# Altium schematic sheet Camera Board.SchDoc
size A4; SheetNumber: 1; SheetTotal: 1
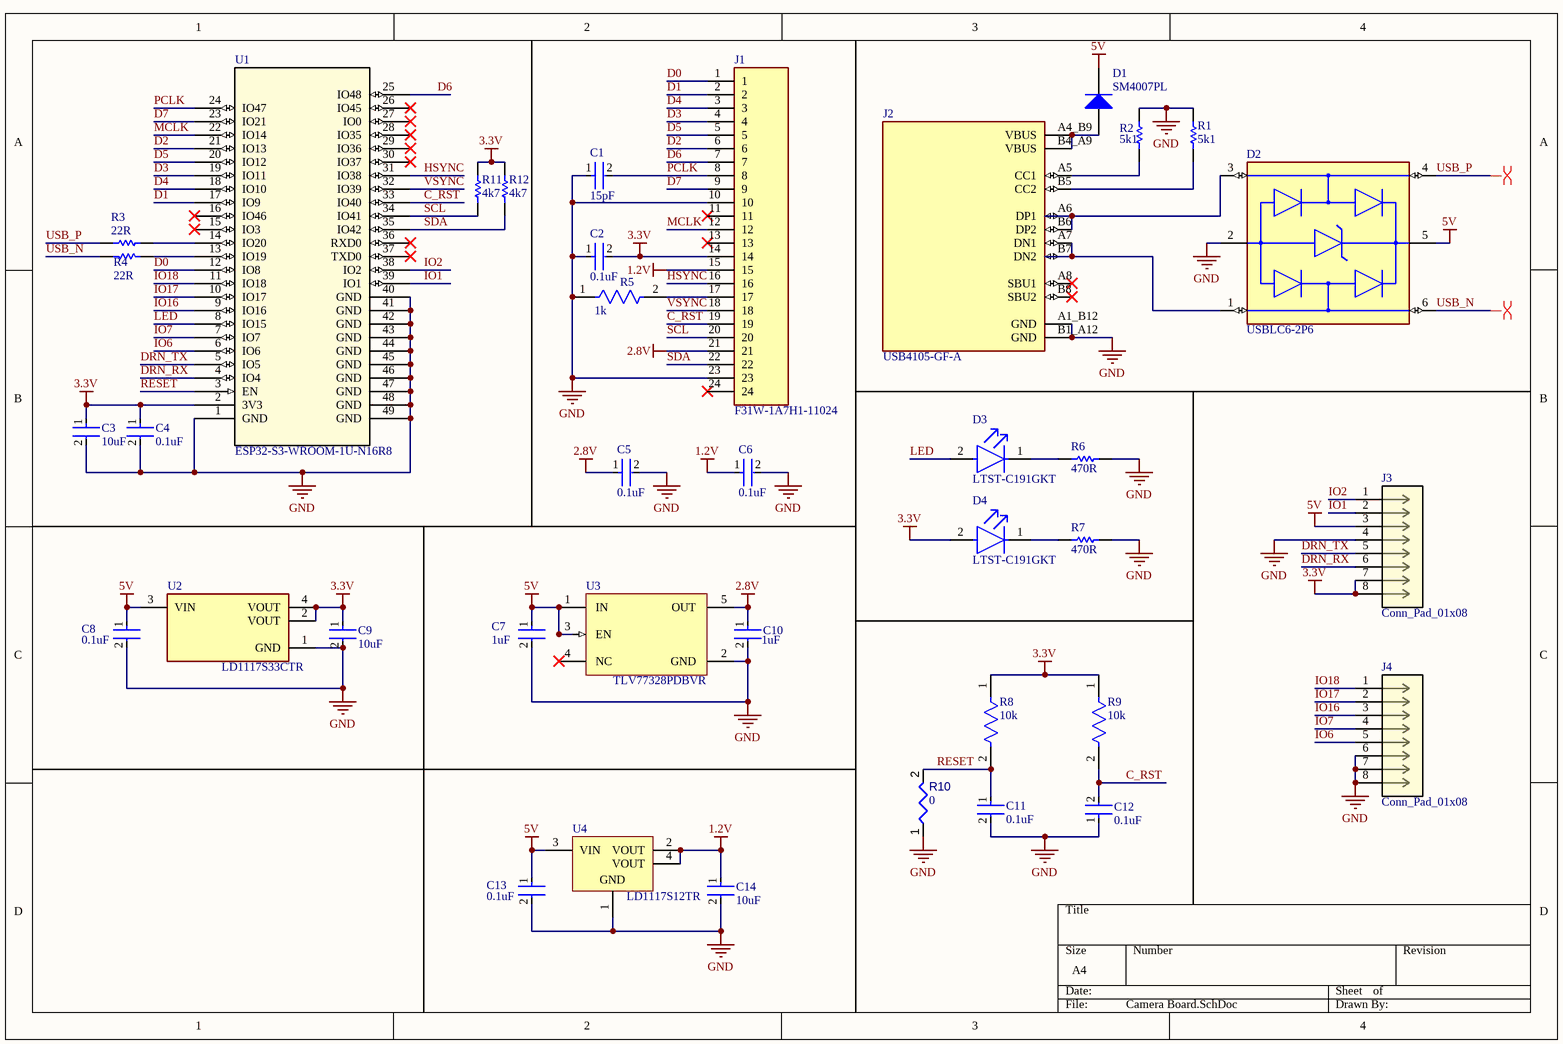
[diagram p0: Camera Board.SchDoc]

## Parts
C1  15pF  [FP-CC0402-0_55-IPC_B]
C2  0.1uF  [FP-GRM155-0_05-IPC_B]
C3  10uF  [FP-GRM18-0_15-MFG]
C4  0.1uF  [FP-CC0603-DA-MFG]
C5  0.1uF  [FP-GRM155-0_05-IPC_B]
C6  0.1uF  [FP-GRM155-0_05-IPC_B]
C7  1uF  [FP-CC0603-DB-MFG]
C8  0.1uF  [FP-CC0603-DA-MFG]
C9  10uF  [FP-GRM18-0_15-MFG]
C10  1uF  [FP-CC0603-DB-MFG]
C11  0.1uF  [FP-CC0603-DA-MFG]
C12  0.1uF  [FP-GRM155-0_05-IPC_B]
C13  0.1uF  [FP-CC0603-DA-MFG]
C14  10uF  [FP-GRM18-0_15-MFG]
D1  SM4007PL  [MCC-SOD-123FL_V]
D2  USBLC6-2P6  [FP-SOT-666-MFG]
D3  LTST-C191GKT  [FP-LTST-C191GKT-MFG]
D4  LTST-C191GKT  [FP-LTST-C191GKT-MFG]
J1  F31W-1A7H1-11024  [AMPHENOL_F31W-1A7H1-11024]
J2  USB4105-GF-A  [GCT_USB4105-GF-A]
J3  Conn_Pad_01x08  [CONN_SM08B-GHS-TB_JST]
J4  Conn_Pad_01x08  [CONN_SM08B-GHS-TB_JST]
R1  5k1  [RESC1608X55X25ML10T15]
R2  5k1  [RESC1608X55X25ML10T15]
R3  22R  [RESC1608X55X25NL10T15]
R4  22R  [RESC1608X55X25NL10T15]
R5  1k  [FP-RC0603-0_55-IPC_C]
R6  470R  [RESC1608X55X25LL10T15]
R7  470R  [RESC1608X55X25LL10T15]
R8  10k  [FP-RC0603-0_55-IPC_C]
R9  10k  [FP-RC0603-0_55-IPC_C]
R10  value 0  [RESC0603(1608)_L]  (hidden comment: Jumper 0603)
R11  4k7  [RESC1608X55X25LL10T15]
R12  4k7  [RESC1608X55X25LL10T15]
U1  ESP32-S3-WROOM-1U-N16R8  [ESP32-S3-WROOM-1U_EXP]
U2  LD1117S33CTR  [FP-SOT-223-0046067_14-MFG]
U3  TLV77328PDBVR  [DBV0005A_MFG]
U4  LD1117S12TR  [SOT-223_M]

## Nets
1.2V: C6.1 C14.1 J1.15 U4.2(VOUT) U4.4(VOUT)
2.8V: C5.1 C10.1 J1.21 U3.5(OUT)
3.3V: C2.2 C3.1 C4.1 C9.1 D4.2(A) J1.14 J3.7 J3.8 R8.1 R9.1 R11.2 R12.2 U1.2(3V3) U2.2(VOUT) U2.4(VOUT)
5V: C7.1 C8.1 C13.1 D1.2(K) D2.5(VBUS) J3.3 U2.3(VIN) U3.1(IN) U3.3(EN) U4.3(VIN)
GND: C1.1 C2.1 C3.2 C4.2 C5.2 C6.2 C7.2 C8.2 C9.2 C10.2 C11.2 C12.1 C13.2 C14.2 D2.2(GND) J1.10 J1.23 J2.A1_B12(GND) J2.B1_A12(GND) J3.4 J4.6 J4.7 J4.8 R1.2 R2.2 R5.1 R6.2 R7.2 R10.1 U1.1(GND) U1.40(GND) U1.41(GND) U1.42(GND) U1.43(GND) U1.44(GND) U1.45(GND) U1.46(GND) U1.47(GND) U1.48(GND) U1.49(GND) U2.1(GND) U3.2(GND) U4.1(GND)
C_RST: C12.2 J1.19 R9.2 U1.33(IO40)
D0: J1.1 U1.12(IO8)
D1: J1.2 U1.17(IO9)
D2: J1.6 U1.21(IO13)
D3: J1.4 U1.19(IO11)
D4: J1.3 U1.18(IO10)
D5: J1.5 U1.20(IO12)
D6: J1.7 U1.25(IO48)
D7: J1.9 U1.23(IO21)
DRN_RX: J3.6 U1.4(IO4)
DRN_TX: J3.5 U1.5(IO5)
HSYNC: J1.16 U1.31(IO38)
IO1: J3.2 U1.39(IO1)
IO2: J3.1 U1.38(IO2)
IO6: J4.5 U1.6(IO6)
IO7: J4.4 U1.7(IO7)
IO16: J4.3 U1.9(IO16)
IO17: J4.2 U1.10(IO17)
IO18: J4.1 U1.11(IO18)
LED: D3.2(A) U1.8(IO15)
MCLK: J1.12 U1.22(IO14)
PCLK: C1.2 J1.8 U1.24(IO47)
RESET: C11.1 R8.2 R10.2 U1.3(EN)
SCL: J1.20 R11.1 U1.34(IO41)
SDA: J1.22 R12.1 U1.35(IO42)
USB_N: D2.6(I/O1) R4.1
USB_P: D2.4(I/O2) R3.1
VSYNC: J1.18 U1.32(IO39)
NetD1_1: D1.1(A) J2.A4_B9(VBUS) J2.B4_A9(VBUS)
NetD2_1: D2.1(I/O1) J2.A7(DN1) J2.B7(DN2)
NetD2_3: D2.3(I/O2) J2.A6(DP1) J2.B6(DP2)
NetD3_1: D3.1(C) R6.1
NetD4_1: D4.1(C) R7.1
NetJ1_17: J1.17 R5.2
NetJ2_A5: J2.A5(CC1) R2.1
NetJ2_B5: J2.B5(CC2) R1.1
NetR3_2: R3.2 U1.14(IO20)
NetR4_2: R4.2 U1.13(IO19)

Not connected (* = marked no-connect by the designer): J1 11* 13* 24*; J2 A8(SBU1)* B8(SBU2)*; U1 15(IO3)* 16(IO46)* 26(IO45)* 27(IO0)* 28(IO35)* 29(IO36)* 30(IO37)* 36(RXD0)* 37(TXD0)*; U3 4(NC)*

## Layout directives
differential pair: USB_N, USB_P

## Library data of the parts
C1 = CMP-03422-001519-1: CAP CER 15PF 50V C0G/NPO 0402; Insulation Resistance: 100GR; Dielectric Material: Ceramic; Tolerance: 5%; Dielectric: C0G; Width: 0.02inch; Case Code (Imperial): 0402; Voltage Rating (DC): 50V; Case Code (Metric): 1005; REACH SVHC: No SVHC; Mount: Surface Mount; Min Operating Temperature: -55°C; Depth: 0.5mm; Voltage Rating: 50V; Voltage: 50V; Thickness: 0.022inch; Length: 1mm; Max Operating Temperature: 125°C; Lead Free: Lead Free; Capacitance: 15pF; Height: 0.5mm; Packaging: Tape and Reel; Radiation Hardening: No; Package Quantity: 1; Case/Package: 0402; Number of Pins: 2; RoHS Compliant: Yes; Resistor Type: Ceramic; Series: CC; Termination: SMD/SMT; JLCNUM: C1548
C2 C5 C6 C12 = CMP-2008-04639-2: Chip Multilayer Ceramic Capacitors for General Purpose, 0402, 0.10uF, X7R, 15%, 10%, 50V; Dissipation Factor: 0.025%; Capacitance: 100nF; Weight: 0.000212oz; Thickness: 0.022inch; Voltage Rating (DC): 50V; Dielectric Material: Ceramic; Termination: SMD/SMT; Case/Package: 0402; Case Code (Imperial): 0402; Mount: Surface Mount; REACH SVHC: No SVHC; Resistor Type: Ceramic; Dielectric: X7R; Max Operating Temperature: 125°C; Voltage: 50V; Lead Free: Lead Free; Package Quantity: 10000; Packaging: Tape and Reel; Length: 1mm; Material: Ceramic; Height: 0.5mm; Depth: 0.5mm; Width: 0.5mm; Min Operating Temperature: -55°C; Tolerance: 10%; Case Code (Metric): 1005; Voltage Rating: 50V; JLCNUM: C307331
  C5 C6: Parameter 1: *
C3 C9 C14 = CMP-2000-05448-2: CAP CER 10UF 10V X5R 0603; Manufacturer Part Number: GRM188R61A106KE69D; Manufacturer: Murata; Temperature Coefficient: 15%; Material: Ceramic; Tolerance: 10%; Device Class L1: Passive Components; ComponentLink2Description: Datasheet; Height: 0.95mm; Package: GRM18-0.15; Octopart: https://octopart.com/grm188r61a106ke69d-murata-22851381; Value: 10uF; Digikey Description: CAP CER 10UF 10V X5R 0603; Temperature Range High: +85°C; Temperature Range Low: -55°C; Temperature Characteristic: X5R; Capacitance: 10uF; RoHS: TRUE; Device Class L2: Capacitors; ComponentLink2URL: https://search.murata.co.jp/Ceramy/image/img/A01X/G101/ENG/GRM188R61A106KE69-01A.pdf; Device Class L3: Ceramic Capacitors; Lead Free: Yes; Mouser Description: Multilayer Ceramic Capacitors MLCC - SMD/SMT 0603 10uF 10volts X5R + - 10%; Category: Cap; Voltage Rating: 10V; Temperature: -55°C to +85°C; Automotive: No; JLCNUM: C19702
C4 C8 C11 C13 = CMP-2100-03601-2: CAP CER 0.1UF 50V X7R 0603; Manufacturer: YAGEO; Manufacturer Part Number: CC0603KRX7R9BB104; Material: Ceramic; Capacitance: 100 nF; Temperature Coefficient: 15%; Tolerance: 0.1; Value: 100 nF; Height: 0.9mm; Voltage: 50 V; ComponentLink2Description: Datasheet; Device Class L2: Capacitors; Temperature Range High: +125°C; Category: Cap; Footprint Url: http://www.yageo.com/exep/pages/download/literatures/UPY-C_GEN_24.pdf; ComponentLink2URL: http://www.yageo.com/documents/recent/UPY-GPHC_X7R_6.3V-to-50V_18.pdf; Package: CC0603-DA; Temperature: -55°C to +125°C; Voltage Rating: 50 V; Temperature Characteristic: X7R; Device Class L1: Passive Components; Temperature Range Low: -55°C; RoHS: TRUE; Automotive: No; Device Class L3: Ceramic Capacitors; Octopart: https://octopart.com/cc0603krx7r9bb104-yageo-42244635; Mouser Description: Multilayer Ceramic Capacitor, CC Series, 0.1 - F, - 10%, X7R, 50 V, 0603 [1608 Metric]; Lead Free: Yes; Digikey Description: CAP CER 0.1UF 50V X7R 0603; JLCNUM: C14663
C7 C10 = CMP-03422-000761-2: CAP CER 1UF 50V X7R 0603; Tolerance: 10%; Lead Free: Lead Free; Max Operating Temperature: 125°C; Width: 0.031inch; Voltage Rating: 50V; Mount: Surface Mount; Resistor Type: Ceramic; Halogen Free: Halogen Free; Weight: 7.1E-05oz; Voltage Rating (DC): 50V; Package Quantity: 4000; Termination: SMD/SMT; Length: 0.063inch; Min Operating Temperature: -55°C; Dielectric: X7R; Case Code (Metric): 1608; Case Code (Imperial): 0603; Packaging: Tape and Reel; Thickness: 0.035inch; Capacitance: 1uF; Case/Package: 0603; JLCNUM: C15849
D1 = CMP-2000-07084-1: Silion Rectifier, 1 A, 1000 V, -65 to 175 degC, 2-Pin SMD, RoHS, Tape and Reel; Manufacturer: Micro Commercial Components; Diode Configuration: Single; Diode Type: StandardRecovery; Forward Surge Current Ifsm Max: 30A; Forward Current If(AV): 1A; Forward Voltage VF Max: 1.1V; Repetitive Reverse Voltage Vrrm Max: 1kV; Manufacturer URL: http://www.mccsemi.com/; Datasheet URL: http://www.mccsemi.com/up_pdf/SM4001PL-SM4007PL(SOD-123FL).PDF; Package Description: 2-Pin Small Outline Diode, Flat Lead, Body 2.825 x 1.65 mm; Datasheet Version: Rev. H, 05/2015; Package Reference: SOD-123FL; Mounting Technology: SurfaceMount; JLCNUM: C64898
D2 = CMP-12225-000058-1: TVS DIODE 5.25V 17V SOT666; Min Breakdown Voltage: 6V; Power Line Protection: Yes; Element Configuration: Dual; Test Current: 1mA; Working Voltage: 5V; Number of Channels: 2; Max Reverse Leakage Current: 150nA; Direction: Unidirectional; Peak Pulse Current: 5A; Number of Elements: 1; Capacitance: 3.5pF; Max Breakdown Voltage: 6V; Height: 0.6mm; Depth: 1.3mm; Contact Plating: Tin; Reverse Breakdown Voltage: 6V; REACH SVHC: No SVHC; Operating Supply Voltage: 5V; Width: 1.3mm; Max Operating Temperature: 125°C; Reverse Standoff Voltage: 5V; ESD Protection: Yes; Package Quantity: 1; Termination: SMD/SMT; Length: 1.7mm; Leakage Current: 150nA; Number of Bidirectional Channels: 2; Case/Package: SOT-666; Min Operating Temperature: -40°C; Number of Pins: 6; Clamping Voltage: 17V; Breakdown Voltage: 6V; Lead Free: Lead Free; Radiation Hardening: No; Packaging: Tape and Reel; Mount: Surface Mount; Polarity: Unidirectional; JLCNUM: C15999
D3 D4 = CMP-22017-000029-1: LED GREEN CLEAR CHIP SMD; Power Dissipation: 100mW; Lens Color: Colorless; Number of Elements: 1; Dominant Wavelength: 569nm; Forward Voltage: 2.1V; Forward Current: 30mA; Test Current: 20mA; Viewing Angle: 130°; Wavelength: 565nm; Luminous Intensity: 12mcd; Reverse Voltage: 5V; Case/Package: 0603; Package Quantity: 1; Illumination Color: Green; Lens Style: Clear; Lens Transparency: Clear; Depth: 0.8mm; Power Rating: 100mW; Width: 0.8mm; Height: 0.55mm; Radiation Hardening: No; Case Code (Imperial): 0603; Number of Pins: 2; Length: 1.6mm; Case Code (Metric): 1608; Max Operating Temperature: 85°C; Color: Green; Packaging: Tape and Reel; Mount: Surface Mount; Min Operating Temperature: -55°C; Lead Free: Lead Free; Number of LEDs: 1; JLCNUM: C99289
J1 = CMP-002-00071-1: Flex Connector, 0.50mm Pitch, Height 4.25mm, Vertical, Slider type, ZIF, 24 position, Without MYLAR; MF: Amphenol ICC / Aorora; MP: F31W-1A7H1-11024; Case/Package: None; Component Type: Standard; Check_prices: https://www.snapeda.com/parts/F31W-1A7H1-11024/Amphenol/view-part/?ref=eda; Pins: 24; Value: *; Design Item ID: F31W-1A7H1-11024; Source: F31W-1A7H1-11024.SchLib; SnapEDA_Link: https://www.snapeda.com/parts/F31W-1A7H1-11024/Amphenol/view-part/?ref=snap; JLCNUM: C5406215
J2 = CMP-003-000000-3: MF: {'manufacturer': u'GCT'}; Source: USB4105-GF-A.SchLib; Value: *; Design Item ID: USB4105-GF-A; Package: None; MP: USB4105-GF-A; Component Type: Standard; Pin Count: 16; Price: None; Availability: Unavailable; JLCNUM: C2765186
J3 J4 = CMP-005-000000-3: Description; RefDes: RefDes; Copyright: Copyright (C) 2026 Ultra Librarian. All rights reserved.; Design Item ID: Conn_Pad_8; Type: Type
R1 R2 = CMP-2000-04091-1: Manufacturer: Yageo; Part Number: RC0603FR-075K1L; JLCNUM: C23186
R3 R4 = CMP-1659-00033-1: Chip Resistor, 22 Ohm, +/- 1%, 0.1 W, -55 to 155 degC, 0603 (1608 Metric), RoHS, Tape and Reel; Max Ouput Current: 8 A; Case\Package: SIP; Max Input Voltage: 1.4 V; ComponentLink2URL: http://www.yageo.com/documents/recent/PYu-RC_Group_51_RoHS_L_04.pdf; RoHSCompliant: true; Max Operating Temperature: 100 degC; PackageDescription: 2-Pin Surface Mount Device, Body 1.6 x 0.8 mm; ComponentLink1Description: Manufacturer URL; ComponentLink1URL: http://www.yageo.com/; Length: 18.5 mm; REACH SVHC: Unknown; Pins: 4; DatasheetVersion: Rev. 4, 02/2016; PackageReference: 0603; Output Current: 8 A; Min Operating Temperature: -25 degC; Height: 19.6 mm; Mount: Through Hole; Radiation Hardening: No; ComponentLink2Description: Datasheet; Package Quantity: 200; Packaging: Rail/Tube; JLCNUM: C23345
R5 = CMP-1659-00009-5: RES 1K OHM 1% 1/10W 0603; Resistance: 1kR; Voltage Rating: 50V; Power Rating: 100mW; Temperature Coefficient: 100ppm/°C; Military Standard: Not; REACH SVHC: No SVHC; Size Code: 0603; Features: Moisture Resistant; Number of Terminations: 2; Technology: THICK FILM; Series: RC; Case Code (Metric): 1608; Resistance Tolerance: 1%; Resistor Type: Thick Film; Termination: SMD/SMT; Contact Plating: Tin; Radiation Hardening: No; Min Operating Temperature: -55°C; Max Operating Temperature: 155°C; Packaging: Tape and Reel; Max Power Dissipation: 100mW; RoHS Compliant: Yes; Height: 0.45mm; Lead Free: Lead Free; Case/Package: 0603; Length: 1.6mm; Tolerance: 1%; Case Code (Imperial): 0603; Construction: Rectangular; Depth: 0.8mm; JLCNUM: C21190
R6 R7 = CMP-1659-00035-2: General Purpose Chip Resistor, 470 Ohm, +/- 1%, -55 to 155 degC, 0603 (1608 Metric), RoHS, Tape and Reel; Resistance: 470 Ohm; ComponentLink1Description: Manufacturer URL; Contact Plating: Gold; Width: 3.1 mm; Radiation Hardening: No; DatasheetVersion: Rev. 4, 04/2009; Length: 3 mm; PackageDescription: 2-Pin Surface Mount Device, Body 1.6 x 0.8 mm; ComponentLink1URL: http://www.yageo.com/; Min Operating Temperature: -40 degC; Mount: Surface Mount; Package Quantity: 2500; ComponentLink2URL: https://datasheet.ciiva.com/11808/0900766b80f96399-11808177.pdf; RoHSCompliant: true; Fastening Type: Snap; PackageReference: 0603; Max Operating Temperature: 90 degC; Height: 1.25 mm; Packaging: Tape and Reel; ComponentLink2Description: Datasheet; Contact Material: Brass; JLCNUM: C23179
R8 R9 = CMP-2100-03664-2: RES 10K OHM 1% 1/10W 0603; Voltage Rating: 75V; Voltage Rating (DC): 50V; Resistance: 10kR; Power Rating: 100mW; Temperature Coefficient: 100ppm/°C; Depth: 0.8mm; Termination: SMD/SMT; Resistor Type: Thick Film; Series: RC; Construction: Rectangular; Features: Moisture Resistant; Packaging: Tape and Reel; Min Operating Temperature: -55°C; Number of Terminations: 2; Lead Pitch: 0.3mm; RoHS Compliant: Yes; Case/Package: 0603; Resistance Tolerance: 1%; Military Standard: Not; Weight: 7.1E-05oz; Number of Pins: 2; Tolerance: 1%; Length: 1.6mm; Case Code (Imperial): 0603; Lead Free: Lead Free; Width: 0.8mm; Max Power Dissipation: 100mW; Height: 0.45mm; Max Operating Temperature: 155°C; Case Code (Metric): 1608; Size Code: 0603; JLCNUM: C25804
R10 = CMP-009-00175-3: Pins: 2; Min Operating Temperature: -55°C; Max Operating Temperature: 155°C; Case/Package: 0603
R11 R12 = CMP-2000-06942-1: Chip Resistor, 4.7 KOhm, +/- 1%, 0.1 W, -55 to 155 degC, 0603 (1608 Metric), RoHS, Tape and Reel; Manufacturer: Yageo; Power Rating: 100mW; Temperature Coefficient: 100PPM/C; Resistance: 4.7kOhms; Voltage Rating: 50V; Package Reference: 0603; Series: RC; Datasheet Version: Rev. 7, 05/2017; Packaging: Reel; Termination Style: SMD/SMT; Datasheet URL: http://www.yageo.com/documents/recent/PYu-RC_Group_51_RoHS_L_7.pdf; Manufacturer URL: http://www.yageo.com/; Package Description: 2-Pin Surface Mount Device, Body 1.6 x 0.8 mm; Case Code - mm: 1608; Case Code - in: 0603; Mounting Technology: SurfaceMount; Operating Temperature Range: -55Cto+155C; Tolerance: 1%; Product: ThickFilmResistorsGeneralPurpose; JLCNUM: C23162
U1 = CMP-288-000000-2: Description; Manufacturer_Name: Espressif Systems; Type: Type; Copyright: Copyright (C) 2025 Ultra Librarian. All rights reserved.; Source: ESP32-S3-WROOM-1U-N16R8.SchLib; Design Item ID: ESP32-S3-WROOM-1U-N16R8; Manufacturer_Part_Number: ESP32-S3-WROOM-1U-N16R8; RefDes: RefDes; JLCNUM: C3013946
U2 = CMP-0244-00307-2: IC REG LINEAR 3.3V 800MA SOT223; Input Bias Current: 5mA; Output Voltage Accuracy: 1%; Dropout Voltage: 1.1V; Power Dissipation: 12W; Polarity: Positive; Min Input Voltage: 5.3V; Quiescent Current: 10mA; Max Output Current: 1.3A; Output Current: 950mA; Number of Regulators: 1; Max Supply Voltage: 15V; Output Type: Fixed; Output Voltage: 3.3V; Number of Terminals: 4; Min Supply Voltage: 3.3V; Termination: SMD/SMT; Mount: Surface Mount; Max Power Dissipation: 12W; Case/Package: SOT-223; Lead Free: Lead Free; Height: 1.8mm; REACH SVHC: No SVHC; Radiation Hardening: No; Width: 3.5mm; Length: 6.5mm; Packaging: Tape and Reel; Max Input Voltage: 15V; Accuracy: 1%; Weight: 0.01lb; Contact Plating: Tin; Max Operating Temperature: 125°C; Number of Pins: 4; Max Output Voltage: 3.3V; Min Operating Temperature: -40°C; Nominal Output Voltage: 3.3V; Package Quantity: 1; Min Output Voltage: 3.3V; Number of Outputs: 1; JLCNUM: C35879
U3 = CMP-00370-149257704-1: 300-mA high-PSRR low-IQ low-dropout regulator with enable 5-SOT-23 -40 to 85; Manufacturer Lifecycle Status: ACTIVE; Lifecycle Status: Production; Width: 1.6mm; HelpURL: https://www.ti.com/lit/ds/symlink/tlv773.pdf; Height: 1.45mm; ComponentLink2URL: https://www.ti.com/lit/ds/symlink/tlv773.pdf; ComponentLink1URL: http://ti.com; ComponentLink2Description: Datasheet URL; Length: 2.9mm; ComponentLink1Description: Manufacturer's Website; Case/Package: SOT-23; RoHS: Compliant; Thickness: 1.2mm; Number of Pins: 5; JLCNUM: C31261045
U4 = CMP-0244-00318-1: Fixed Low Drop Positive Voltage Regulator, 1.2V, 4-Pin SOT-223, Tape and Reel; PackageDescription: 4-Pin SOT-223 Package, 6.5 x 3.5 mm Body, 2.3 mm Pitch, 7 mm Lead Span; PackageVersion: 2010; ComponentLink2Description: Datasheet; PackageReference: SOT-223; ComponentLink2URL: http://www.st.com/internet/com/TECHNICAL_RESOURCES/TECHNICAL_LITERATURE/DATASHEET/CD00000544.pdf; ComponentLink1Description: Manufacturer URL; DatasheetVersion: 1/11/2011; ComponentLink1URL: http://www.st.com; JLCNUM: C155612